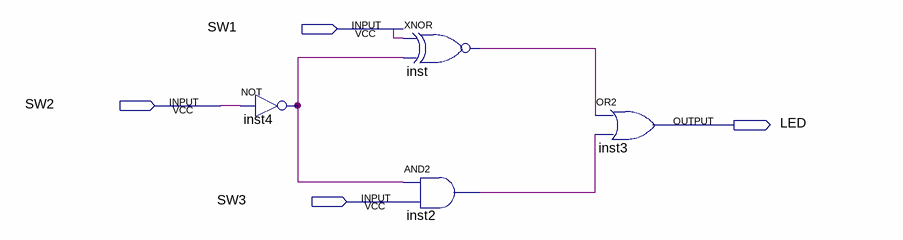
[diagram p0: schematic sheet]
// Quartus schematic Block4.bdf as structural Verilog: 4 symbols, 4 pins
module Block4 (
  input  SW1,
  input  SW2,
  input  SW3,
  output LED
);

  wire inst2_out, inst4_out, inst_out;

  not inst4 (inst4_out, SW2);
  xnor inst (inst_out, SW1, inst4_out);
  and inst2 (inst2_out, inst4_out, SW3);
  or inst3 (LED, inst_out, inst2_out);
endmodule
